# Altium project PCB_Project.PrjPcb
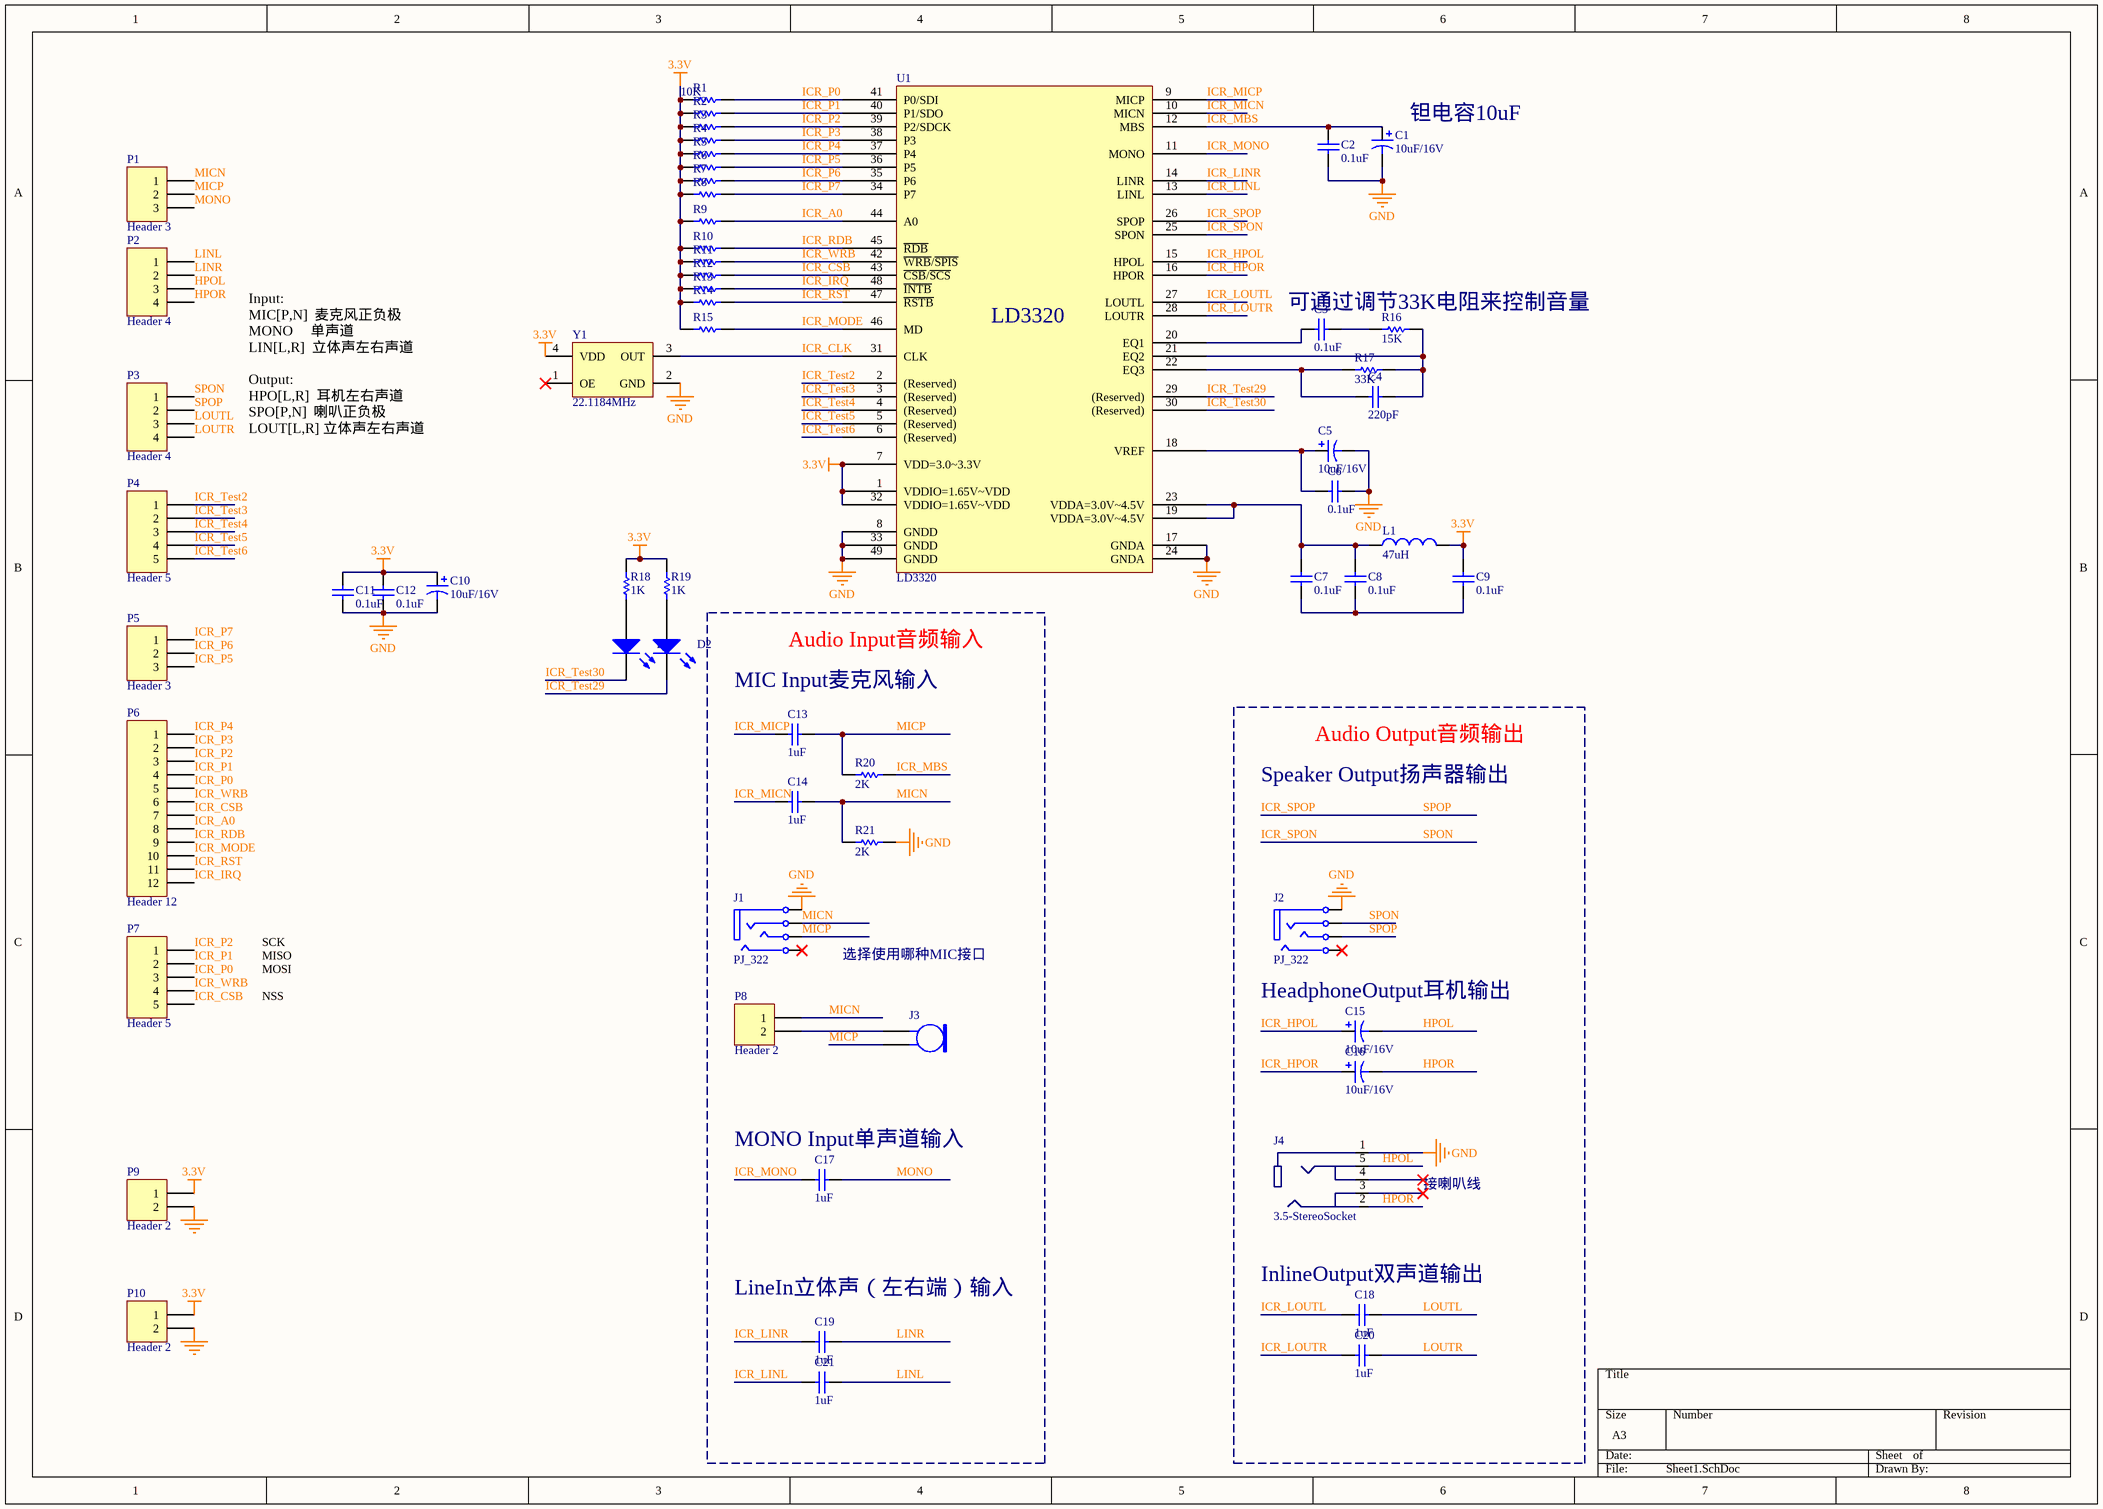
[diagram p0: Sheet1.SchDoc]
1 sheet, 61 parts. Net scope: global (net labels, ports and power ports of the same name join across sheets).
Board file: PCB1.PcbDoc

## Sheet Sheet1.SchDoc
size A3

### Parts
C1  value 10uF/16V  [1206]  (hidden comment: Cap Pol1)
C2  value 0.1uF  [0603]  (hidden comment: Cap)
C3  value 0.1uF  [0603]  (hidden comment: Cap)
C4  value 220pF  [0603]  (hidden comment: Cap)
C5  value 10uF/16V  [1206]  (hidden comment: Cap Pol1)
C6  value 0.1uF  [0603]  (hidden comment: Cap)
C7  value 0.1uF  [0603]  (hidden comment: Cap)
C8  value 0.1uF  [0603]  (hidden comment: Cap)
C9  value 0.1uF  [0603]  (hidden comment: Cap)
C10  value 10uF/16V  [1206]  (hidden comment: Cap Pol1)
C11  value 0.1uF  [0603]  (hidden comment: Cap)
C12  value 0.1uF  [0603]  (hidden comment: Cap)
C13  value 1uF  [0603]  (hidden comment: Cap)
C14  value 1uF  [0603]  (hidden comment: Cap)
C15  value 10uF/16V  [1206]  (hidden comment: Cap Pol1)
C16  value 10uF/16V  [1206]  (hidden comment: Cap Pol1)
C17  value 1uF  [0603]  (hidden comment: Cap)
C18  value 1uF  [0603]  (hidden comment: Cap)
C19  value 1uF  [0603]  (hidden comment: Cap)
C20  value 1uF  [0603]  (hidden comment: Cap)
C21  value 1uF  [0603]  (hidden comment: Cap)
D1  LED2  [0603-LED]  (value not drawn)
D2  LED2  [0603-LED]  (value not drawn)
J1  PJ_322  [PJ_322]
J2  PJ_322  [PJ_322]
J3  Mic2  [9*7mic]  (value not drawn)
J4  3.5-StereoSocket  [3F07]
L1  value 47uH  [0805]  (hidden comment: Inductor)
P1  Header 3  [HDR1X3]
P2  Header 4  [HDR1X4]
P3  Header 4  [HDR1X4]
P4  Header 5  [HDR1X5]
P5  Header 3  [HDR1X3]
P6  Header 12  [HDR1X12]
P7  Header 5  [HDR1X5]
P8  Header 2  [HDR1X2]
P9  Header 2  [HDR1X2]
P10  Header 2  [HDR1X2]
R1  value 10K  [0603]  (hidden comment: Res1)
R2  Res1  [0603]  (value not drawn)
R3  Res1  [0603]  (value not drawn)
R4  Res1  [0603]  (value not drawn)
R5  Res1  [0603]  (value not drawn)
R6  Res1  [0603]  (value not drawn)
R7  Res1  [0603]  (value not drawn)
R8  Res1  [0603]  (value not drawn)
R9  Res1  [0603]  (value not drawn)
R10  Res1  [0603]  (value not drawn)
R11  Res1  [0603]  (value not drawn)
R12  Res1  [0603]  (value not drawn)
R13  Res1  [0603]  (value not drawn)
R14  Res1  [0603]  (value not drawn)
R15  Res1  [0603]  (value not drawn)
R16  value 15K  [0603]  (hidden comment: Res1)
R17  value 33K  [0603]  (hidden comment: Res1)
R18  value 1K  [0603]  (hidden comment: Res1)
R19  value 1K  [0603]  (hidden comment: Res1)
R20  value 2K  [0603]  (hidden comment: Res1)
R21  value 2K  [0603]  (hidden comment: Res1)
U1  LD3320  [QFN-48P]
Y1  22.1184MHz  [5*3.2]

### Nets
3.3V: C9.1 C10.1 C11.2 C12.2 L1.2 P9.1 P10.1 R1.2 R2.2 R3.2 R4.2 R5.2 R6.2 R7.2 R8.2 R9.2 R10.2 R11.2 R12.2 R13.2 R14.2 R15.2 R18.2 R19.2 U1.1(VDDIO=1.65V~VDD) U1.7(VDD=3.0~3.3V) U1.32(VDDIO=1.65V~VDD) Y1.4(VDD)
GND: C1.2 C2.1 C5.2 C6.1 C10.2 C11.1 C12.1 J1.1(S) J2.1(S) J4.1(GND) P9.2 P10.2 R21.2 U1.8(GNDD) U1.17(GNDA) U1.24(GNDA) U1.33(GNDD) U1.49(GNDD) Y1.2(GND)
HPOL: C15.2 J4.5 P2.3
HPOR: C16.2 J4.2 P2.4
ICR_A0: P6.8 R9.1 U1.44(A0)
ICR_CLK: U1.31(CLK) Y1.3(OUT)
ICR_CSB: P6.7 P7.5 R12.1 U1.43(~{CSB}/~{SCS})
ICR_HPOL: C15.1 U1.15(HPOL)
ICR_HPOR: C16.1 U1.16(HPOR)
ICR_IRQ: P6.12 R13.1 U1.48(~{INTB})
ICR_LINL: C21.1 U1.13(LINL)
ICR_LINR: C19.1 U1.14(LINR)
ICR_LOUTL: C18.1 U1.27(LOUTL)
ICR_LOUTR: C20.1 U1.28(LOUTR)
ICR_MBS: C1.1 C2.2 R20.2 U1.12(MBS)
ICR_MICN: C14.1 U1.10(MICN)
ICR_MICP: C13.1 U1.9(MICP)
ICR_MODE: P6.10 R15.1 U1.46(MD)
ICR_MONO: C17.1 U1.11(MONO)
ICR_P0: P6.5 P7.3 R1.1 U1.41(P0/SDI)
ICR_P1: P6.4 P7.2 R2.1 U1.40(P1/SDO)
ICR_P2: P6.3 P7.1 R3.1 U1.39(P2/SDCK)
ICR_P3: P6.2 R4.1 U1.38(P3)
ICR_P4: P6.1 R5.1 U1.37(P4)
ICR_P5: P5.3 R6.1 U1.36(P5)
ICR_P6: P5.2 R7.1 U1.35(P6)
ICR_P7: P5.1 R8.1 U1.34(P7)
ICR_RDB: P6.9 R10.1 U1.45(~{RDB})
ICR_RST: P6.11 R14.1 U1.47(~{RSTB})
ICR_SPON: J2.2(R) P3.1 U1.25(SPON)  [also labelled SPON]
ICR_SPOP: J2.3(T) P3.2 U1.26(SPOP)  [also labelled SPOP]
ICR_Test2: P4.1 U1.2((Reserved))
ICR_Test3: P4.2 U1.3((Reserved))
ICR_Test4: P4.3 U1.4((Reserved))
ICR_Test5: P4.4 U1.5((Reserved))
ICR_Test6: P4.5 U1.6((Reserved))
ICR_Test29: D2.2(K) U1.29((Reserved))
ICR_Test30: D1.2(K) U1.30((Reserved))
ICR_WRB: P6.6 P7.4 R11.1 U1.42(~{WRB}/~{SPIS})
LINL: C21.2 P2.1
LINR: C19.2 P2.2
LOUTL: C18.2 P3.3
LOUTR: C20.2 P3.4
MICN: C14.2 J1.2(R) P1.1 P8.1 R21.1
MICP: C13.2 J1.3(T) J3.2 P1.2 R20.1
MONO: C17.2 P1.3
NetC3_1: C3.1 R16.1
NetC3_2: C3.2 U1.20(EQ1)
NetC4_1: C4.1 R16.2 R17.2 U1.21(EQ2)
NetC4_2: C4.2 R17.1 U1.22(EQ3)
NetC5_1: C5.1 C6.2 U1.18(VREF)
NetC7_1: C7.1 C8.1 L1.1 U1.19(VDDA=3.0V~4.5V) U1.23(VDDA=3.0V~4.5V)
NetC7_2: C7.2 C8.2 C9.2
NetD1_1: D1.1(A) R18.1
NetD2_1: D2.1(A) R19.1
NetJ3_1: J3.1 P8.2

Not connected (* = marked no-connect by the designer): J1 4(T)*; J2 4(T)*; J4 3* 4*; Y1 1(OE)*

### Notes on the sheet
- (near C1) 钽电容10uF
- 可通过调节33K电阻来控制音量
- (near Y1) Input:
  MIC[P,N]		麦克风正负极
  MONO   		单声道
  LIN[L,R]		立体声左右声道
  Output:
  HPO[L,R]		耳机左右声道
  SPO[P,N]		喇叭正负极
  LOUT[L,R]	立体声左右声道
- Audio Input音频输入
- (near C13) MIC Input麦克风输入
- Speaker Output扬声器输出
- Audio Output音频输出
- MISO
- MOSI
- SCK
- 选择使用哪种MIC接口
- NSS
- HeadphoneOutput耳机输出
- (near C17) MONO Input单声道输入
- 接喇叭线
- (near C19) LineIn立体声（左右端）输入
- (near C18) InlineOutput双声道输出

### Library data of the parts
C1 C5 C10 C15 C16 = Cap Pol1: Polarized Capacitor (Radial); Published: 8-Jun-2000; LatestRevisionDate: 17-Jul-2002; LatestRevisionNote: Re-released for DXP Platform.; PackageReference: RB7.6-15; Publisher: Altium Limited; PackageDescription: Polarized Capacitor (Radial); 2 Leads
C2-C4 C6-C9 C11-C14 C17-C21 = Cap: Capacitor; Published: 8-Jun-2000; LatestRevisionDate: 17-Jul-2002; LatestRevisionNote: Re-released for DXP Platform.; PackageReference: RAD-0.3; Publisher: Altium Limited; PackageDescription: Radial Cap, Thru-Hole; 2 Leads; 0.3 in Pin Spacing
D1 D2 = LED2: Typical RED, GREEN, YELLOW, AMBER GaAs LED; Published: 8-Jun-2000; LatestRevisionDate: 17-Jul-2002; LatestRevisionNote: Re-released for DXP Platform.; PackageVersion: Feb-2002; PackageReference: 3.2X1.6X1.1; Publisher: Altium Limited; PackageDescription: SM LED; 2 Flat Leads
J3 = Mic2: Microphone; Published: 24-Mar-1999; LatestRevisionDate: 17-Jul-2002; LatestRevisionNote: Re-released for DXP Platform.; PackageReference: PIN2; Publisher: Altium Limited
J4 = 3.5-StereoSocket: AudioSocket
L1 = Inductor: Code_IEC: 1005; Published: 8-Jun-2000; LatestRevisionDate: 29-May-2009; LatestRevisionNote: IPC-7351 Footprint Added.; PackageReference: 0402-A; Publisher: Altium Limited; PackageDescription: Chip Inductor; Code_JEITA: 0402
P1 P5 = Header 3: Header, 3-Pin; LatestRevisionDate: 17-Jul-2002; LatestRevisionNote: Re-released for DXP Platform.; Publisher: Altium Limited
P2 P3 = Header 4: Header, 4-Pin; LatestRevisionDate: 17-Jul-2002; LatestRevisionNote: Re-released for DXP Platform.; Publisher: Altium Limited
P4 P7 = Header 5: Header, 5-Pin; LatestRevisionDate: 17-Jul-2002; LatestRevisionNote: Re-released for DXP Platform.; Publisher: Altium Limited
P6 = Header 12: Header, 12-Pin; LatestRevisionDate: 17-Jul-2002; LatestRevisionNote: Re-released for DXP Platform.; Publisher: Altium Limited
P8-P10 = Header 2: Header, 2-Pin; LatestRevisionDate: 17-Jul-2002; LatestRevisionNote: Re-released for DXP Platform.; Publisher: Altium Limited
R1 R16-R21 = Res1: Resistor; Published: 8-Jun-2000; LatestRevisionDate: 17-Jul-2002; LatestRevisionNote: Re-released for DXP Platform.; PackageReference: AXIAL-0.3; Publisher: Altium Limited; PackageDescription: Axial Device, Thru-Hole; 2 Leads; 0.3 in Pin Spacing
R2-R15 = Res1: Resistor; Value: 10K; Published: 8-Jun-2000; LatestRevisionDate: 17-Jul-2002; LatestRevisionNote: Re-released for DXP Platform.; PackageReference: AXIAL-0.3; Publisher: Altium Limited; PackageDescription: Axial Device, Thru-Hole; 2 Leads; 0.3 in Pin Spacing
U1 = LD3320: SpeechRecognition
Y1 = SPXO: oscillator